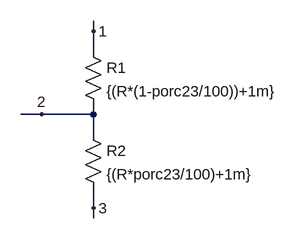
[diagram p0: schematic pote.asc]
pote.asc, the LTspice schematic file:
Version 4
SHEET 1 880 680
WIRE 160 0 160 -16
WIRE 160 32 160 0
WIRE 80 128 48 128
WIRE 160 128 160 112
WIRE 160 128 80 128
WIRE 160 160 160 128
WIRE 160 272 160 240
WIRE 160 288 160 272
FLAG 160 0 1
FLAG 80 128 2
FLAG 160 272 3
SYMBOL res 144 16 R0
SYMATTR InstName R1
SYMATTR Value {(R*(1-porc23/100))+1m}
SYMBOL res 144 144 R0
SYMATTR InstName R2
SYMATTR Value {(R*porc23/100)+1m}

The netlist it stands for:
* pote.asc
R1 1 2 {(R*(1-porc23/100))+1m}
R2 2 3 {(R*porc23/100)+1m}
.backanno
.end